# EAGLE design PCB-SLIDER-S (EAGLE 6.4)
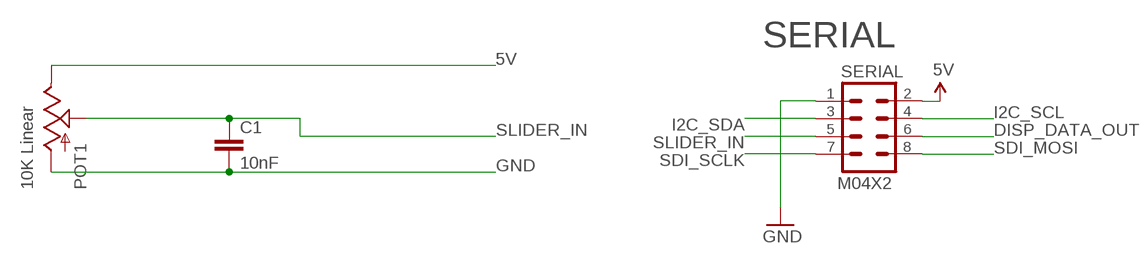
[diagram p0: schematic, sheet 1]

## Parts
C1  10nF  CAP0603-CAP  [0603-CAP]
POT1  10K Linear  SLIDER60  [SLIDER60]
SERIAL  M04X2  [2X4]

## Nets
5V [Power]: POT1.1(E) SERIAL.2
DISP_DATA_OUT: SERIAL.6
GND [Power]: C1.2 POT1.3(A) SERIAL.1
I2C_SCL: SERIAL.4
I2C_SDA: SERIAL.3
SDI_MOSI: SERIAL.8
SDI_SCLK: SERIAL.7
SLIDER_IN: C1.1 POT1.2A(S) SERIAL.5

## Notes on the sheet
- SERIAL

## Library data of the parts
C1 = SparkFun:CAP: Capacitor Standard 0603 ceramic capacitor, and 0.1" leaded capacitor.
POT1 = SKAARHOJ:SLIDER
SERIAL = SparkFun:M04X2

## Net classes
0 default: width 0.203 mm, drill 0.406 mm, clearance 0.203 mm
1 Power: width 0.406 mm, drill 0.61 mm, clearance 0.203 mm

## Board
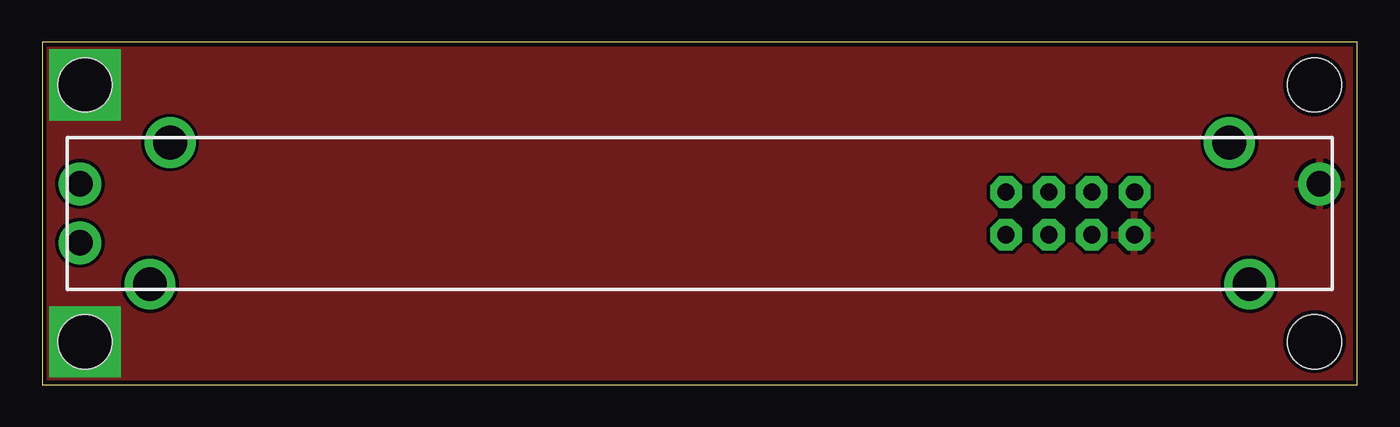
[diagram p1: board, top side]
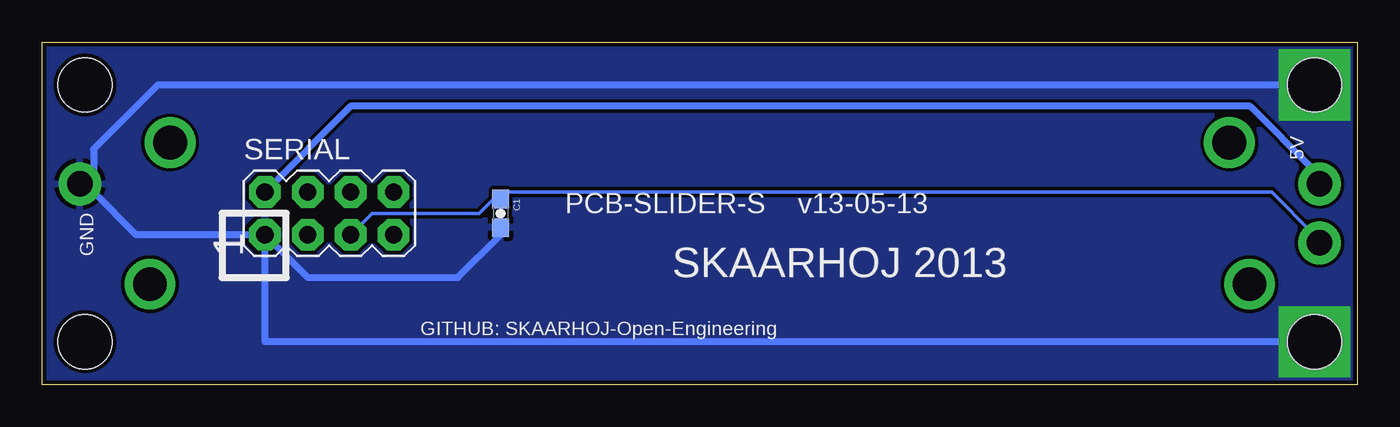
[diagram p2: board, bottom side, seen from below]

Size 77.98 x 20.32 mm. Coordinates in mm from the lower left corner, seen from the top.
Outline: 0,0 77.98,0 77.98,20.32 0,20.32 0,0
Copper layers (1*16): Top 0.035mm / dielectric 1.5mm / Bottom 0.035mm
Design rules "default": minimum track width 6mil, minimum drill 12mil, track to track 6mil, track to pad 6mil, pad to pad 6mil, via to via 6mil, smd to smd 0mil, copper to edge 10mil, drill to drill 10mil, minimum pad ring 10mil, minimum via ring 6mil, stop-mask expansion 2mil, vias tented up to drill 100mil, thermal gap 10mil
Holes 3.2 mm at 2.54,2.54 2.54,17.78 75.44,17.78 75.44,2.54

### Footprints (pad centres in the part's own frame; a part is rotated, then mirrored left to right if it is on the bottom)
0603-CAP = smd 1.1 x 1: 1 -0.85,0; 2 0.85,0
SLIDER60 = drill 1.5 pad 2.54: 1 -36.75,1.75; 2A -36.75,-1.75; 3 36.75,1.75 | drill 2: P$1 -31.4,4.2; P$2 31.4,4.2; P$3 32.6,-4.2; P$4 -32.6,-4.2
2X4 = drill 1.016 pad 1.88 octagon: 1 -3.81,-1.27; 2 -3.81,1.27; 3 -1.27,-1.27; 4 -1.27,1.27; 5 1.27,-1.27; 6 1.27,1.27; 7 3.81,-1.27; 8 3.81,1.27

### Placement (x,y rotation side)
C1  50.8,10.16 270 bottom
POT1  38.99,10.16 0 top
SERIAL  60.96,10.16 0 bottom

### Tracks (layer width: path | path; a pad name or v marks a point on that pad's centre or on a via)
5V
  Bottom 0.406: SERIAL.2 59.69,16.51 6.35,16.51 2.54,12.7 POT1.1
GND  (via drill 3.2)
  Bottom 0.406: SERIAL.1 62.23,6.35 53.34,6.35 50.8,8.89 C1.2 | SERIAL.1 72.39,8.89 74.93,11.43 POT1.3 74.93,12.72 74.93,13.97 71.12,17.78 v2.54,17.78 | v2.54,2.54 64.77,2.54 SERIAL.1
  pour Bottom: 0,0 0,20.32 78.74,20.32 78.74,0
  pour Top: 0,0 0,20.32 78.74,20.32 78.74,0
SLIDER_IN
  Bottom 0.203: 50.8,11.43 52.07,10.16 58.42,10.16 SERIAL.5 | 50.8,11.43 5.08,11.43 2.54,8.89 POT1.2A | 50.8,11.43 C1.1

### Text on the board
_bsilk: 5V | PCB-SLIDER-S v13-05-13 | 1 | GND | SKAARHOJ 2013 | GITHUB: SKAARHOJ-Open-Engineering